# Altium schematic sheet LPCB280 - LIMIT SWITCHES.SchDoc
size A3; Address1: Factory 10; Address2: 9-13 Dingley Avenue, Dandeong, VICTORIA 3175, AUSTRALIA; DocumentNumber: 4; Revision: 1; SheetNumber: 4; SheetTotal: 6; Lockie__PCB_SUB_ASSEMBLY: PCB Sub Component; Lockie__PCB_ASSEMBLY: PCB Assembly; Lockie__LDL: LPCB280; Lockie__PCB_DESCRIPTION: Gimbal Control Unit (GCU)
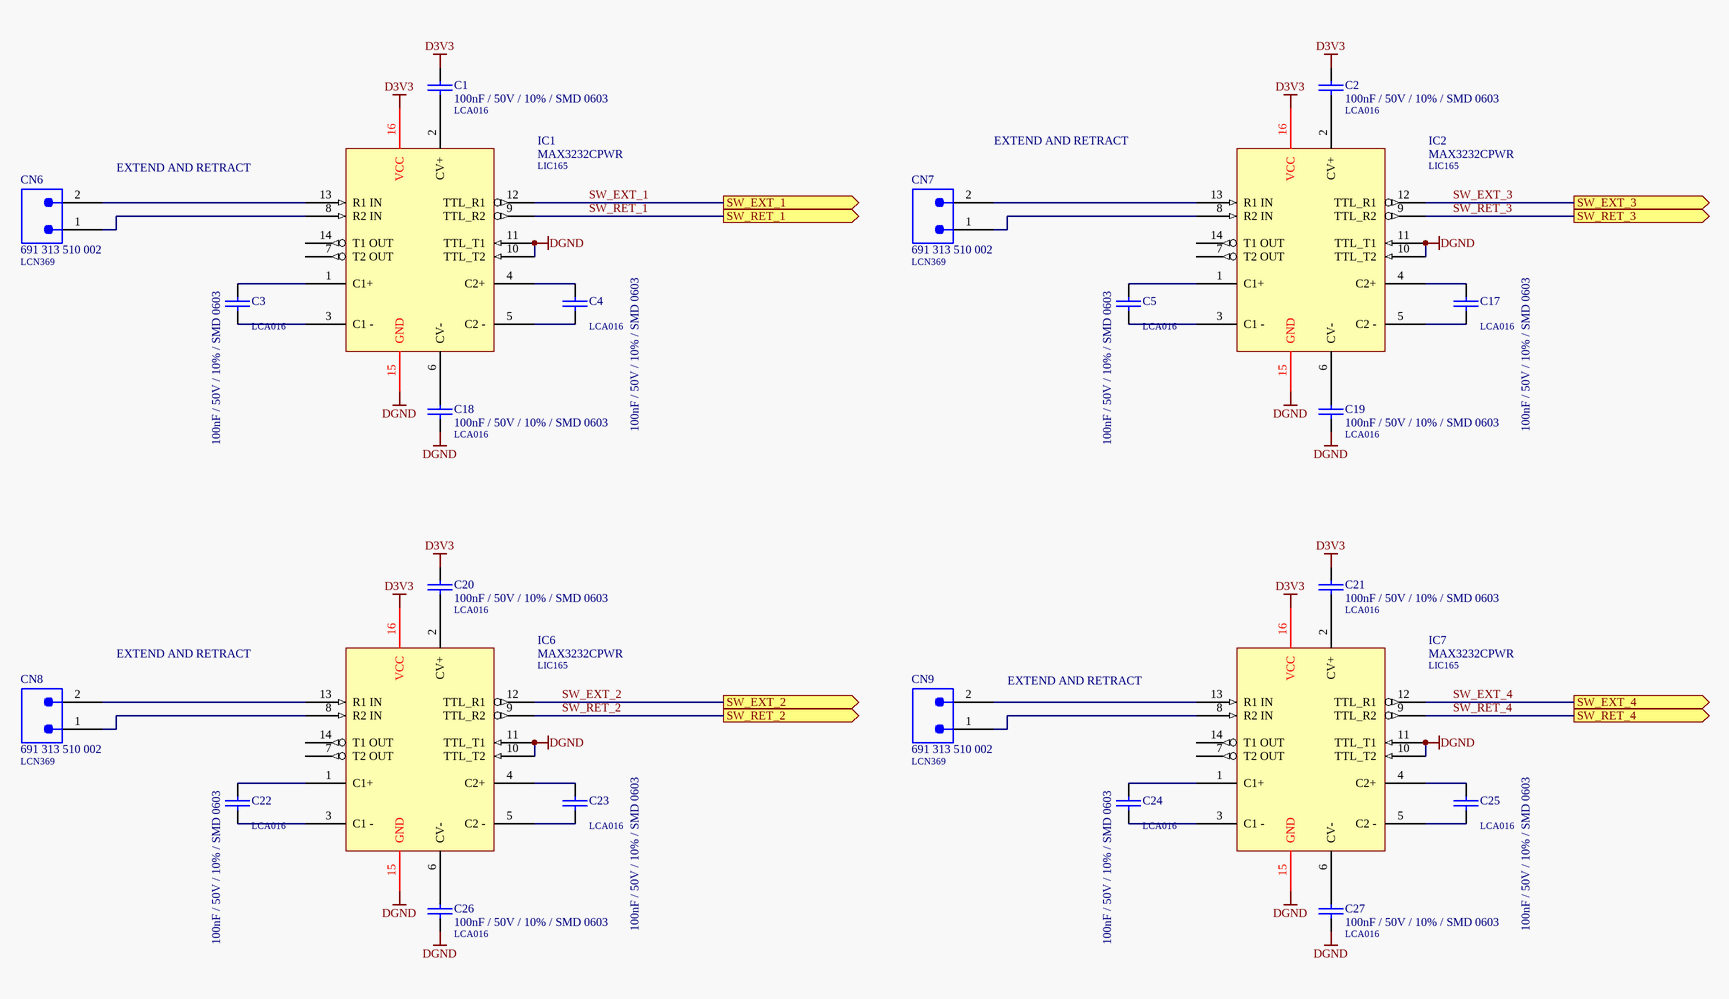
[diagram p0: LPCB280 - LIMIT SWITCHES.SchDoc]

## Parts
C1  100nF / 50V / 10% / SMD 0603  LDL_NUMBER: LCA016  [LFP011__CC1608-0603-IPC7351_B]
C2  100nF / 50V / 10% / SMD 0603  LDL_NUMBER: LCA016  [LFP011__CC1608-0603-IPC7351_B]
C3  100nF / 50V / 10% / SMD 0603  LDL_NUMBER: LCA016  [LFP011__CC1608-0603-IPC7351_B]
C4  100nF / 50V / 10% / SMD 0603  LDL_NUMBER: LCA016  [LFP011__CC1608-0603-IPC7351_B]
C5  100nF / 50V / 10% / SMD 0603  LDL_NUMBER: LCA016  [LFP011__CC1608-0603-IPC7351_B]
C17  100nF / 50V / 10% / SMD 0603  LDL_NUMBER: LCA016  [LFP011__CC1608-0603-IPC7351_B]
C18  100nF / 50V / 10% / SMD 0603  LDL_NUMBER: LCA016  [LFP011__CC1608-0603-IPC7351_B]
C19  100nF / 50V / 10% / SMD 0603  LDL_NUMBER: LCA016  [LFP011__CC1608-0603-IPC7351_B]
C20  100nF / 50V / 10% / SMD 0603  LDL_NUMBER: LCA016  [LFP011__CC1608-0603-IPC7351_B]
C21  100nF / 50V / 10% / SMD 0603  LDL_NUMBER: LCA016  [LFP011__CC1608-0603-IPC7351_B]
C22  100nF / 50V / 10% / SMD 0603  LDL_NUMBER: LCA016  [LFP011__CC1608-0603-IPC7351_B]
C23  100nF / 50V / 10% / SMD 0603  LDL_NUMBER: LCA016  [LFP011__CC1608-0603-IPC7351_B]
C24  100nF / 50V / 10% / SMD 0603  LDL_NUMBER: LCA016  [LFP011__CC1608-0603-IPC7351_B]
C25  100nF / 50V / 10% / SMD 0603  LDL_NUMBER: LCA016  [LFP011__CC1608-0603-IPC7351_B]
C26  100nF / 50V / 10% / SMD 0603  LDL_NUMBER: LCA016  [LFP011__CC1608-0603-IPC7351_B]
C27  100nF / 50V / 10% / SMD 0603  LDL_NUMBER: LCA016  [LFP011__CC1608-0603-IPC7351_B]
CN6  691 313 510 002  LDL_NUMBER: LCN369  [691 313 510 002]
CN7  691 313 510 002  LDL_NUMBER: LCN369  [691 313 510 002]
CN8  691 313 510 002  LDL_NUMBER: LCN369  [691 313 510 002]
CN9  691 313 510 002  LDL_NUMBER: LCN369  [691 313 510 002]
IC1  MAX3232CPWR  LDL_NUMBER: LIC165  [LFP049__TSSOP-16]
IC2  MAX3232CPWR  LDL_NUMBER: LIC165  [LFP049__TSSOP-16]
IC6  MAX3232CPWR  LDL_NUMBER: LIC165  [LFP049__TSSOP-16]
IC7  MAX3232CPWR  LDL_NUMBER: LIC165  [LFP049__TSSOP-16]

## Ports
SW_EXT_1 (out), SW_EXT_2 (out), SW_EXT_3 (out), SW_EXT_4 (out), SW_RET_1 (out), SW_RET_2 (out), SW_RET_3 (out), SW_RET_4 (out)

## Nets
D3V3: C1.1 C2.1 C20.1 C21.1 IC1.16(VCC) IC2.16(VCC) IC6.16(VCC) IC7.16(VCC)
DGND: C18.2 C19.2 C26.2 C27.2 IC1.10(TTL_T2) IC1.11(TTL_T1) IC1.15(GND) IC2.10(TTL_T2) IC2.11(TTL_T1) IC2.15(GND) IC6.10(TTL_T2) IC6.11(TTL_T1) IC6.15(GND) IC7.10(TTL_T2) IC7.11(TTL_T1) IC7.15(GND)
SW_EXT_1: IC1.12(TTL_R1) ; port SW_EXT_1
SW_EXT_2: IC6.12(TTL_R1) ; port SW_EXT_2
SW_EXT_3: IC2.12(TTL_R1) ; port SW_EXT_3
SW_EXT_4: IC7.12(TTL_R1) ; port SW_EXT_4
SW_RET_1: IC1.9(TTL_R2) ; port SW_RET_1
SW_RET_2: IC6.9(TTL_R2) ; port SW_RET_2
SW_RET_3: IC2.9(TTL_R2) ; port SW_RET_3
SW_RET_4: IC7.9(TTL_R2) ; port SW_RET_4
NetC1_2: C1.2 IC1.2(CV+)
NetC2_2: C2.2 IC2.2(CV+)
NetC3_1: C3.1 IC1.1(C1+)
NetC3_2: C3.2 IC1.3(C1_-)
NetC4_1: C4.1 IC1.4(C2+)
NetC4_2: C4.2 IC1.5(C2_-)
NetC5_1: C5.1 IC2.1(C1+)
NetC5_2: C5.2 IC2.3(C1_-)
NetC17_1: C17.1 IC2.4(C2+)
NetC17_2: C17.2 IC2.5(C2_-)
NetC18_1: C18.1 IC1.6(CV-)
NetC19_1: C19.1 IC2.6(CV-)
NetC20_2: C20.2 IC6.2(CV+)
NetC21_2: C21.2 IC7.2(CV+)
NetC22_1: C22.1 IC6.1(C1+)
NetC22_2: C22.2 IC6.3(C1_-)
NetC23_1: C23.1 IC6.4(C2+)
NetC23_2: C23.2 IC6.5(C2_-)
NetC24_1: C24.1 IC7.1(C1+)
NetC24_2: C24.2 IC7.3(C1_-)
NetC25_1: C25.1 IC7.4(C2+)
NetC25_2: C25.2 IC7.5(C2_-)
NetC26_1: C26.1 IC6.6(CV-)
NetC27_1: C27.1 IC7.6(CV-)
NetCN6_1: CN6.1 IC1.8(R2_IN)
NetCN6_2: CN6.2 IC1.13(R1_IN)
NetCN7_1: CN7.1 IC2.8(R2_IN)
NetCN7_2: CN7.2 IC2.13(R1_IN)
NetCN8_1: CN8.1 IC6.8(R2_IN)
NetCN8_2: CN8.2 IC6.13(R1_IN)
NetCN9_1: CN9.1 IC7.8(R2_IN)
NetCN9_2: CN9.2 IC7.13(R1_IN)

Not connected (* = marked no-connect by the designer): IC1 7(T2_OUT) 14(T1_OUT); IC2 7(T2_OUT) 14(T1_OUT); IC6 7(T2_OUT) 14(T1_OUT); IC7 7(T2_OUT) 14(T1_OUT)

## Notes on the sheet
- EXTEND AND RETRACT
- PCB COMPONENT DESCRIPTION
- LDL NUMBER
- Assembly Details
- Size
- Drawing File Name
- Revision
- http://sil3.com.au
  ACN: 123 529 064
  Factory 10
  9-13 Dingley Avenue
  Dandenong, VICTORIA
  Australia
- Scale
- A3
- Sheet Details
- N.T.S
- Sheet:
- Of:

## Library data of the parts
C1-C5 C17-C27 = 100nF / 50V / 10% / SMD 0603: Capacitor, Ceramic Chip, 100nF (0.1uF), 50V, 5%, SMD 0603 [LCA016]; Value: 100n; FMEDA__OPERATING__VOLTAGE_MIN: 0; FMEDA__OPERATING__VOLTAGE_MAX: 3.3; FMEDA__OPERATING__TEMP_MIN: -20; FMEDA__OPERATING__TEMP_TYP: 27; FMEDA__OPERATING__TEMP_MAX: 50; FMEDA__CHANNEL: COM; FMEDA__FUNCTION_IN_SYSTEM: *; FMEDA__OPERATING__VOLTAGE_TYP: 3.3
CN6-CN9 = 691 313 510 002: Connector, Pluggable Terminal Block, 5.08mm, 2 Way, PTH; FMEDA__CHANNEL: COM; FMEDA__OPERATING__CURRENT_MAX: 0; FMEDA__OPERATING__TEMP_MAX: 50; FMEDA__OPERATING__TEMP_MIN: -20; FMEDA__OPERATING__TEMP_TYP: 27; FMEDA__OPERATING__VOLTAGE_MAX: 16; FMEDA__OPERATING__VOLTAGE_TYP: 12; FMEDA__FUNCTION_IN_SYSTEM: *; FMEDA__OPERATING__CURRENT_MIN: 0; FMEDA__OPERATING__CURRENT_TYP: 0; FMEDA__OPERATING__VOLTAGE_MIN: 0
IC1 IC2 IC6 IC7 = MAX3232CPWR: IC, RS232 Line Driver, 3.3V, SMD TSSOP16 [LIC165]; FMEDA__OPERATING__TEMP_MAX: 50; FMEDA__OPERATING__TEMP_MIN: -20; FMEDA__OPERATING__TEMP_TYP: 27; FMEDA__CHANNEL: COM; FMEDA__OPERATING__VOLTAGE_MAX: 3.3; FMEDA__OPERATING__VOLTAGE_MIN: 0; FMEDA__FUNCTION_IN_SYSTEM: *; FMEDA__OPERATING__VOLTAGE_TYP: 3.3